# EasyEDA schematic EasyEDA board_SCH.json
TITLE: HMD; REV: 1.1; Date: 2021-04-28; Sheet: 1/1; Drawn By: LiquidCGS; Company: HadesVR
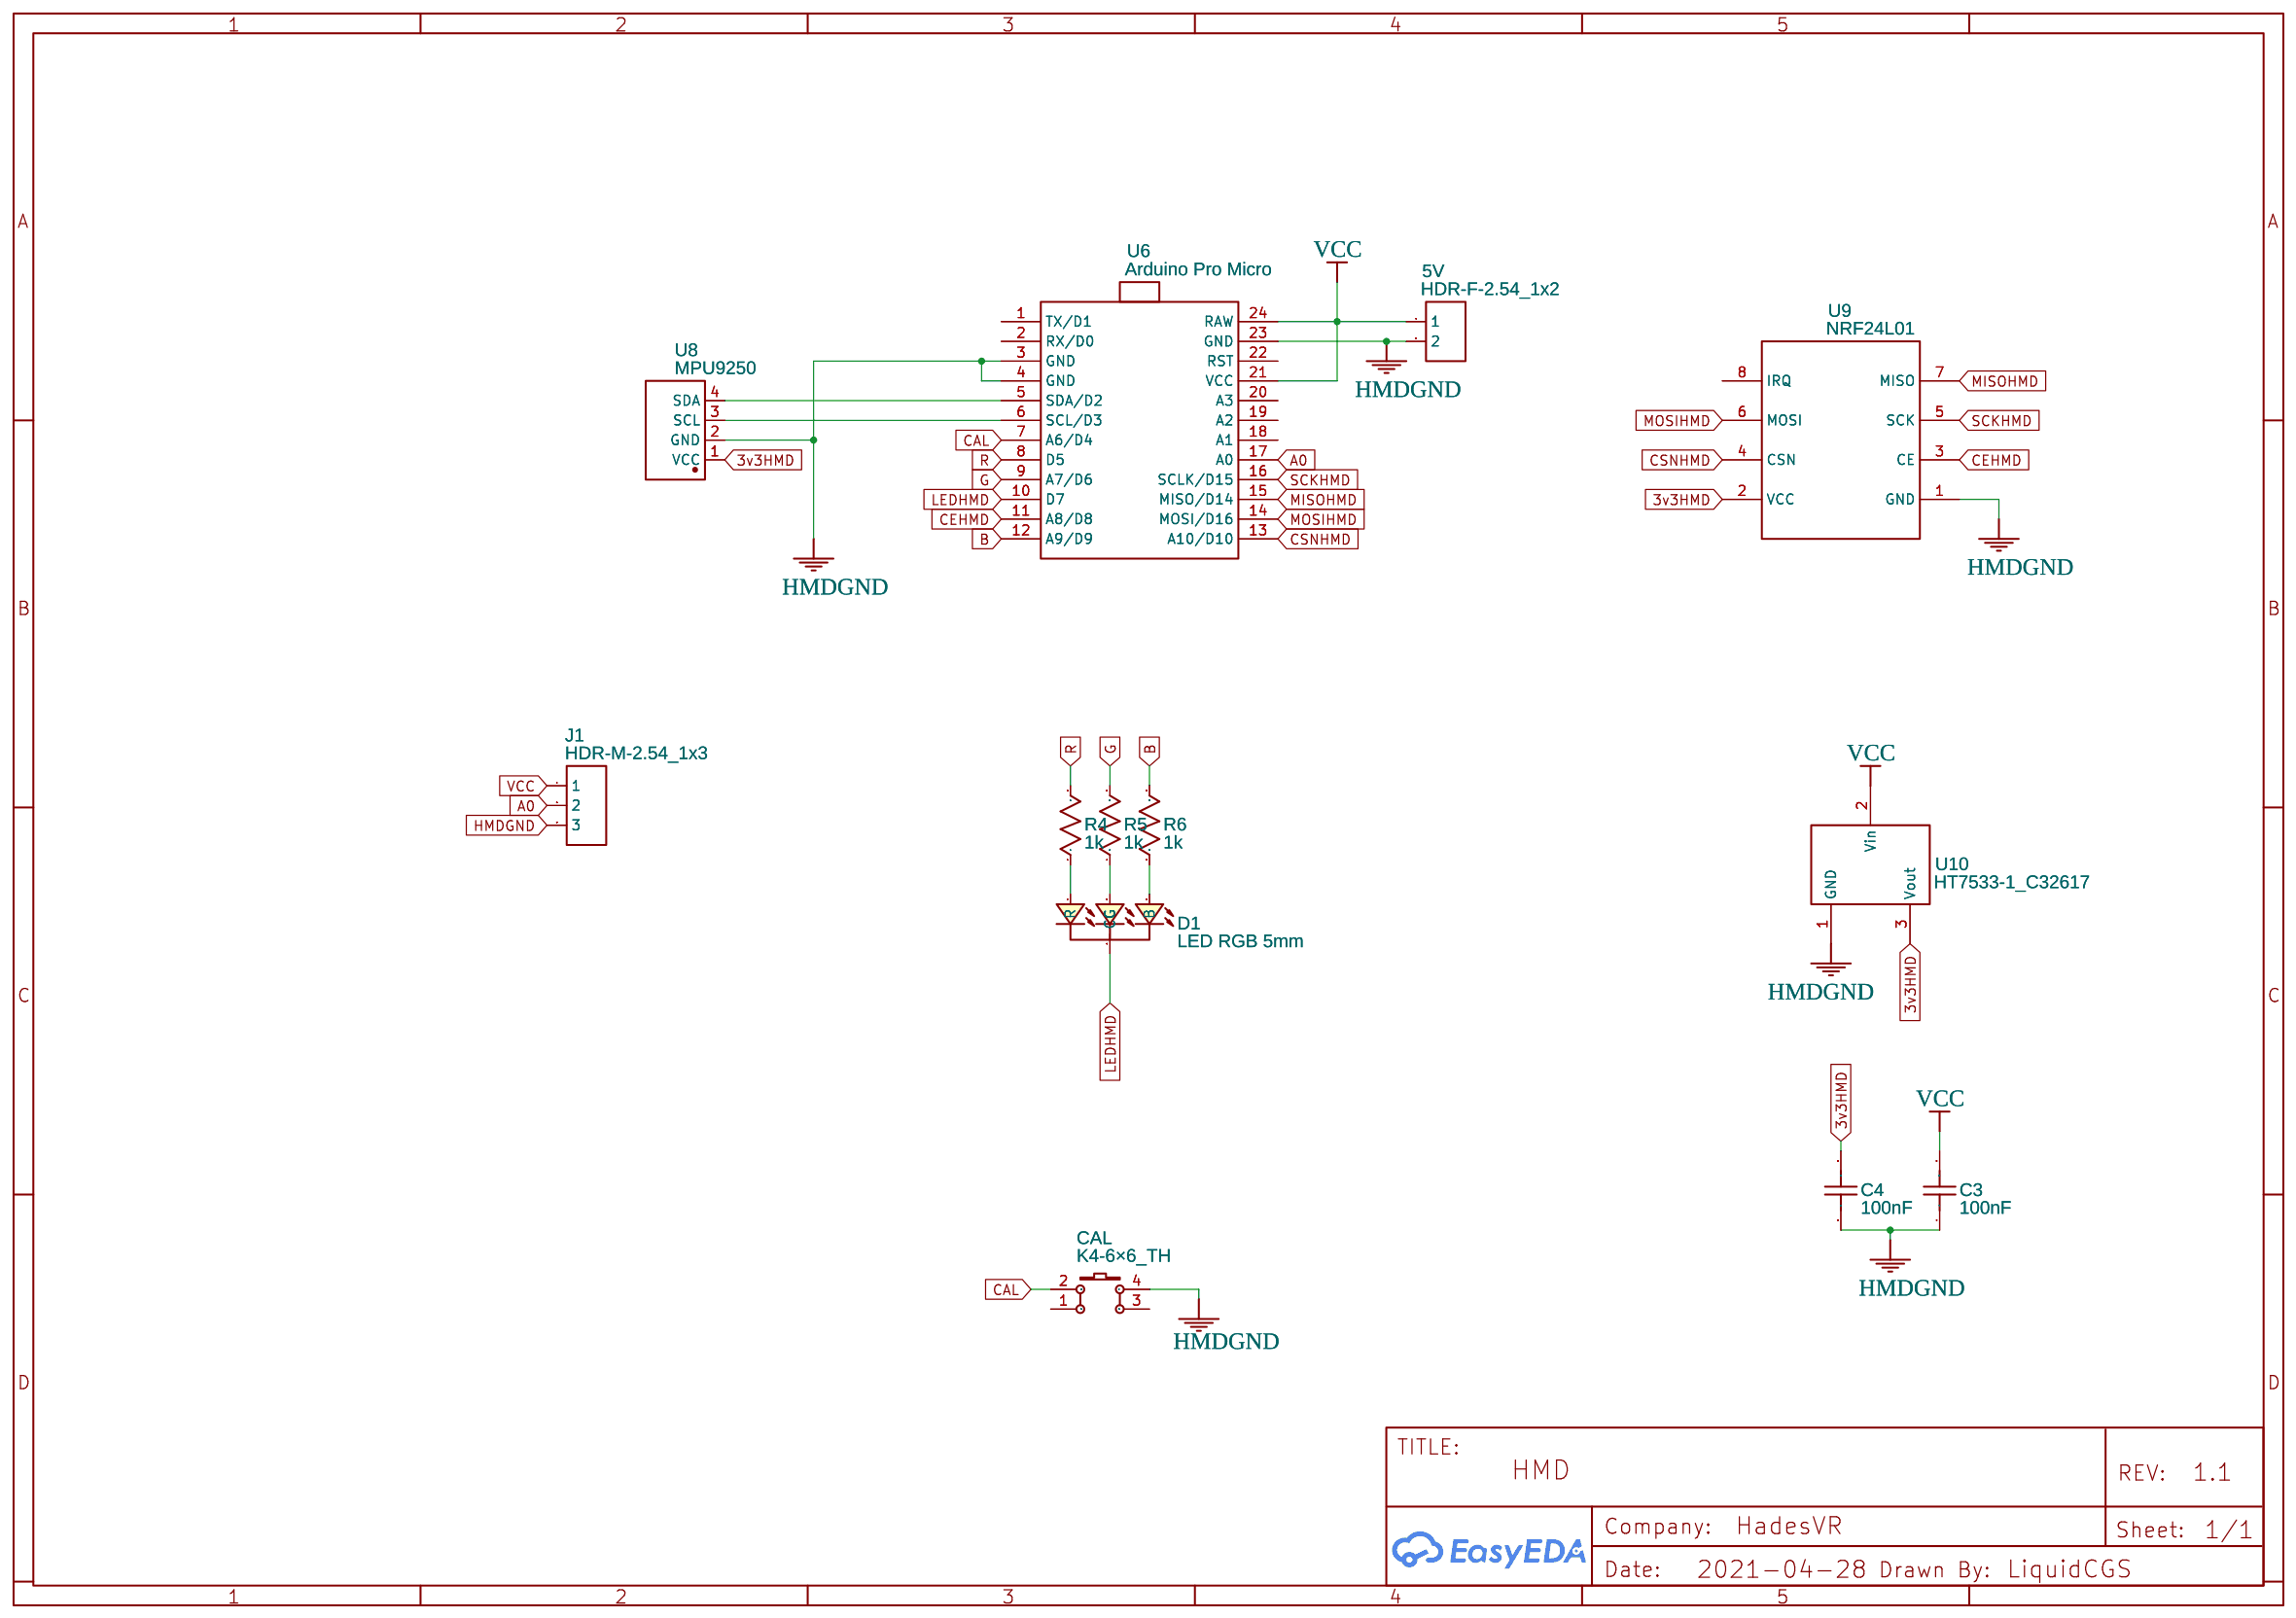
[diagram p0: schematic sheet]

## Parts
5V  HDR-F-2.54_1x2  [HDR-F-2.54_1X2]
C3  100nF  [RAD-0.1]
C4  100nF  [RAD-0.1]
CAL  K4-6×6_TH  [KEY-TH_4P-L6.0-W6.0-P4.50-LS6.5]
D1  LED RGB 5mm  [LED_RGB_5MM]
J1  HDR-M-2.54_1x3  [HDR-M-2.54_1X3]
R4  1k  [R_AXIAL-0.3]
R5  1k  [R_AXIAL-0.3]
R6  1k  [R_AXIAL-0.3]
U6  Arduino Pro Micro  [ARDUINO_PRO_MICRO]
U8  MPU9250  [MPU9250]
U9  NRF24L01  [MOD-NRF24L01]
U10  HT7533-1_C32617  [TO-92-3_L4.9-W3.7-P1.27-L]

## Library data of the parts
5V = HDR-F-2.54_1x2: Supplier Part: C49661; Supplier: LCSC; Contributor: LCEDA_Lib
C3 C4 = C_RAD-0.2_US: Contributor: LCEDA_Lib
CAL = K4-6×6_TH: Supplier: LCSC; Supplier Part: C136684; Manufacturer: 韩国韩荣; Manufacturer Part: K2-1102DP-E4SW-04; Contributor: LCEDA_Lib
D1 = LED RGB 5mm: Manufacturer: Togialed; Manufacturer Part: TJ-L5FYTXHMCSLCRGB-A5; Supplier: LCSC; Supplier Part: C330759; link: https://lcsc.com/product-detail/Others_TOGIALED-TJ-L5FYTXHMCSLCRGB-A5_C330759.html?ref=editor&logined=true; Contributor: PedroM
J1 = HDR-M-2.54_1x3: Supplier Part: C180248; Supplier: LCSC; Contributor: LCEDA_Lib
R4-R6 = R_AXIAL-0.3_US: Contributor: LCEDA_Lib
U6 = Arduino Pro Micro: Contributor: gatoloco65
U8 = MPU9250: Contributor: Виктор Семинченко
U9 = NRF24L01: Contributor: NukeLeo
U10 = HT7533-1_C32617: Supplier: LCSC; Manufacturer: HOLTEK; Manufacturer Part: HT7533-1; image: //image.lceda.cn/szlcsc/C32617.jpg; Supplier Part: C32617; LCSC Assembly: Yes; SMT Type: Extend; Paste Type: expand

## Nets
3v3HMD: C4.2 U8.1(VCC) U9.2(VCC) U10.3(Vout)
VCC: 5V.1 C3.2 J1.1 U6.21(VCC) U6.24(RAW) U10.2(Vin)
A0: J1.2 U6.17(A0)
B: R6.2 U6.12(A9/D9)
CAL: CAL.2 U6.7(A6/D4)
CEHMD: U6.11(A8/D8) U9.3(CE)
CSNHMD: U6.13(A10/D10) U9.4(CSN)
G: R5.2 U6.9(A7/D6)
HMDGND: 5V.2 C3.1 C4.1 CAL.4 J1.3 U6.3(GND) U6.4(GND) U6.23(GND) U8.2(GND) U9.1(GND) U10.1(GND)
LEDHMD: D1.2(CC) U6.10(D7)
MISOHMD: U6.15(MISO/D14) U9.7(MISO)
MOSIHMD: U6.14(MOSI/D16) U9.6(MOSI)
R: R4.2 U6.8(D5)
SCKHMD: U6.16(SCLK/D15) U9.5(SCK)
Net-(D1-1): D1.1(R) R4.1
Net-(D1-3): D1.3(G) R5.1
Net-(D1-4): D1.4(B) R6.1
Net-(U6-5): U6.5(SDA/D2) U8.4(SDA)
Net-(U6-6): U6.6(SCL/D3) U8.3(SCL)

Not connected (* = marked no-connect by the designer): CAL 1 3; U6 1(TX/D1) 2(RX/D0) 18(A1) 19(A2) 20(A3) 22(RST); U9 8(IRQ)
